# EAGLE design Cubesat_Potencia_Painel_Solar (EAGLE 6.2)
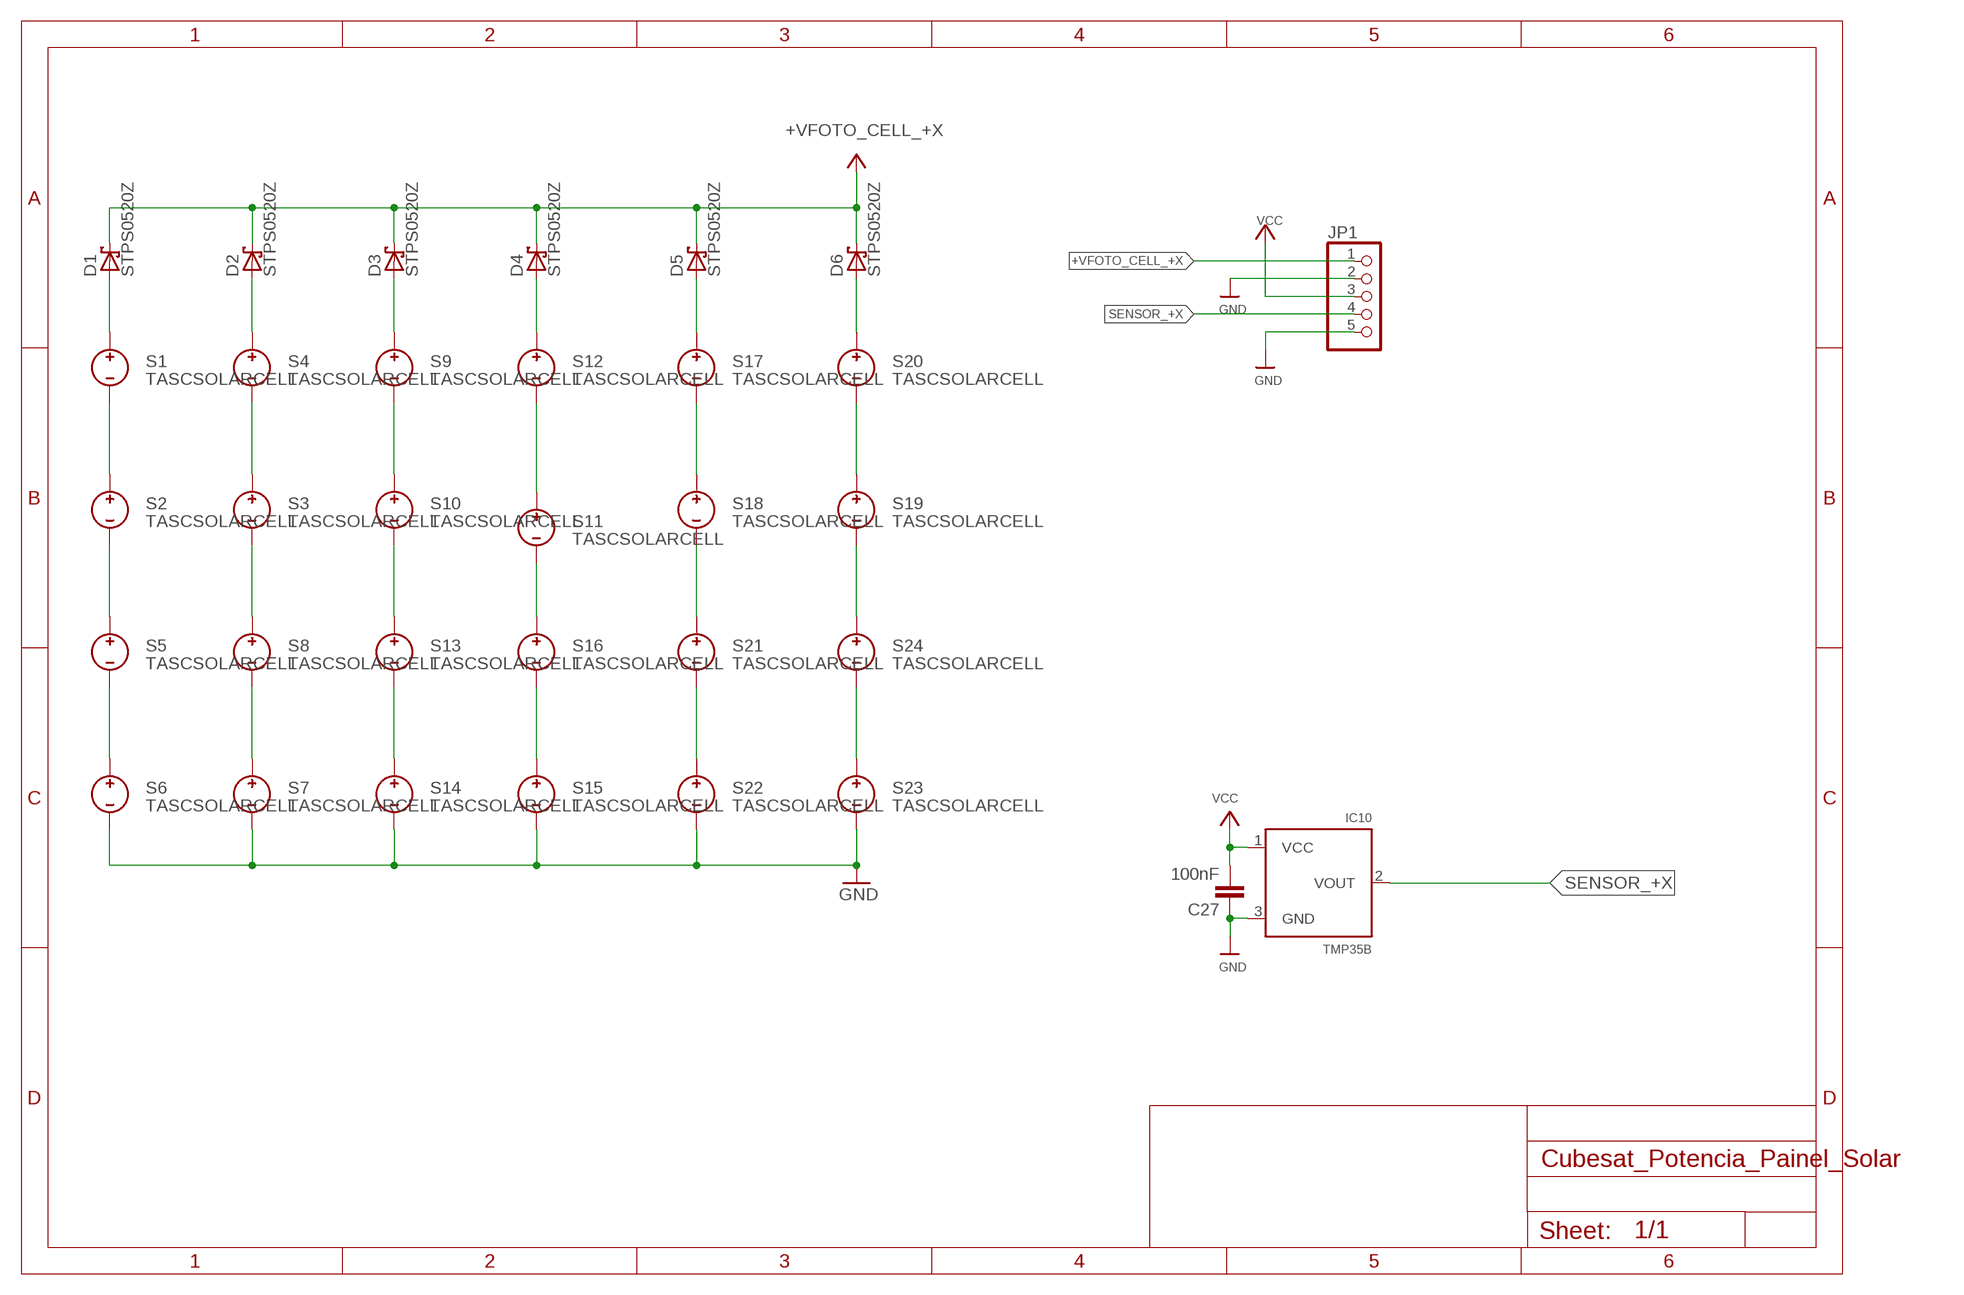
[diagram p0: schematic, sheet 1]

## Parts
C27  100nF  C-EUC0805  [C0805]
D1  STPS0520Z  [SOD-123]
D2  STPS0520Z  [SOD-123]
D3  STPS0520Z  [SOD-123]
D4  STPS0520Z  [SOD-123]
D5  STPS0520Z  [SOD-123]
D6  STPS0520Z  [SOD-123]
IC10  TMP35B  [TO92-LINE]
JP1  HEADER-1X5SMT  [1X05_SMT]
S1  TASCSOLARCELL  [TASCSOLARCELL]
S2  TASCSOLARCELL  [TASCSOLARCELL]
S3  TASCSOLARCELL  [TASCSOLARCELL]
S4  TASCSOLARCELL  [TASCSOLARCELL]
S5  TASCSOLARCELL  [TASCSOLARCELL]
S6  TASCSOLARCELL  [TASCSOLARCELL]
S7  TASCSOLARCELL  [TASCSOLARCELL]
S8  TASCSOLARCELL  [TASCSOLARCELL]
S9  TASCSOLARCELL  [TASCSOLARCELL]
S10  TASCSOLARCELL  [TASCSOLARCELL]
S11  TASCSOLARCELL  [TASCSOLARCELL]
S12  TASCSOLARCELL  [TASCSOLARCELL]
S13  TASCSOLARCELL  [TASCSOLARCELL]
S14  TASCSOLARCELL  [TASCSOLARCELL]
S15  TASCSOLARCELL  [TASCSOLARCELL]
S16  TASCSOLARCELL  [TASCSOLARCELL]
S17  TASCSOLARCELL  [TASCSOLARCELL]
S18  TASCSOLARCELL  [TASCSOLARCELL]
S19  TASCSOLARCELL  [TASCSOLARCELL]
S20  TASCSOLARCELL  [TASCSOLARCELL]
S21  TASCSOLARCELL  [TASCSOLARCELL]
S22  TASCSOLARCELL  [TASCSOLARCELL]
S23  TASCSOLARCELL  [TASCSOLARCELL]
S24  TASCSOLARCELL  [TASCSOLARCELL]

## Nets
+VFOTO_CELL_+X: D1.C D2.C D3.C D4.C D5.C D6.C JP1.1
GND: C27.1 IC10.3(GND) JP1.2 JP1.5 S6.N S7.N S14.N S15.N S22.N S23.N
N$1: D1.A S1.P
N$2: S1.N S2.P
N$3: S2.N S5.P
N$4: S5.N S6.P
N$5: S7.P S8.N
N$6: S3.N S8.P
N$7: S3.P S4.N
N$8: S13.N S14.P
N$9: S10.N S13.P
N$10: S9.N S10.P
N$11: S15.P S16.N
N$12: S11.N S16.P
N$13: S11.P S12.N
N$14: S21.N S22.P
N$15: S18.N S21.P
N$16: S17.N S18.P
N$17: S23.P S24.N
N$18: S19.N S24.P
N$19: S19.P S20.N
N$20: D2.A S4.P
N$21: D3.A S9.P
N$22: D4.A S12.P
N$23: D5.A S17.P
N$24: D6.A S20.P
SENSOR_+X: IC10.2(VOUT) JP1.4
VCC: C27.2 IC10.1(VCC) JP1.3

## Library data of the parts
C27 = rcl:C-EU: CAPACITOR, European symbol
D1-D6 = OSSI:STPS0520Z: We use STPS0520Z by st.com diode for solar cell schottky diode. If = 500mA Vrrm = 20V Vf max = 0.32V
IC10 = junior:TMP35
JP1 = junior:HEADER-1X5: PIN HEADER
S1-S24 = OSSI:TASCSOLARCELL

## Board
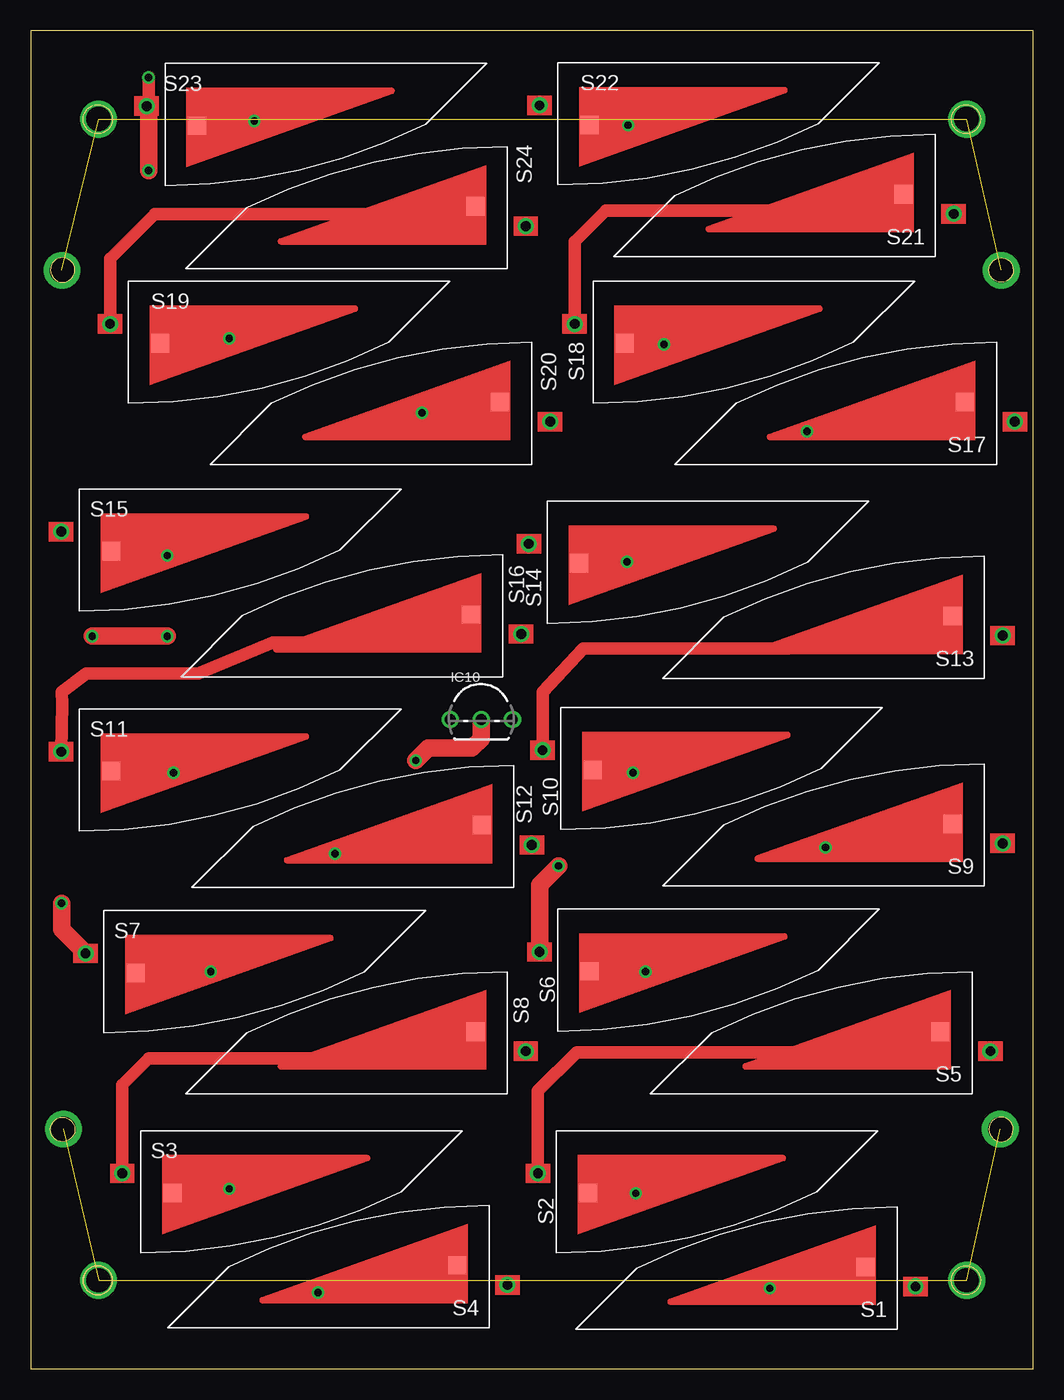
[diagram p1: board, top side]
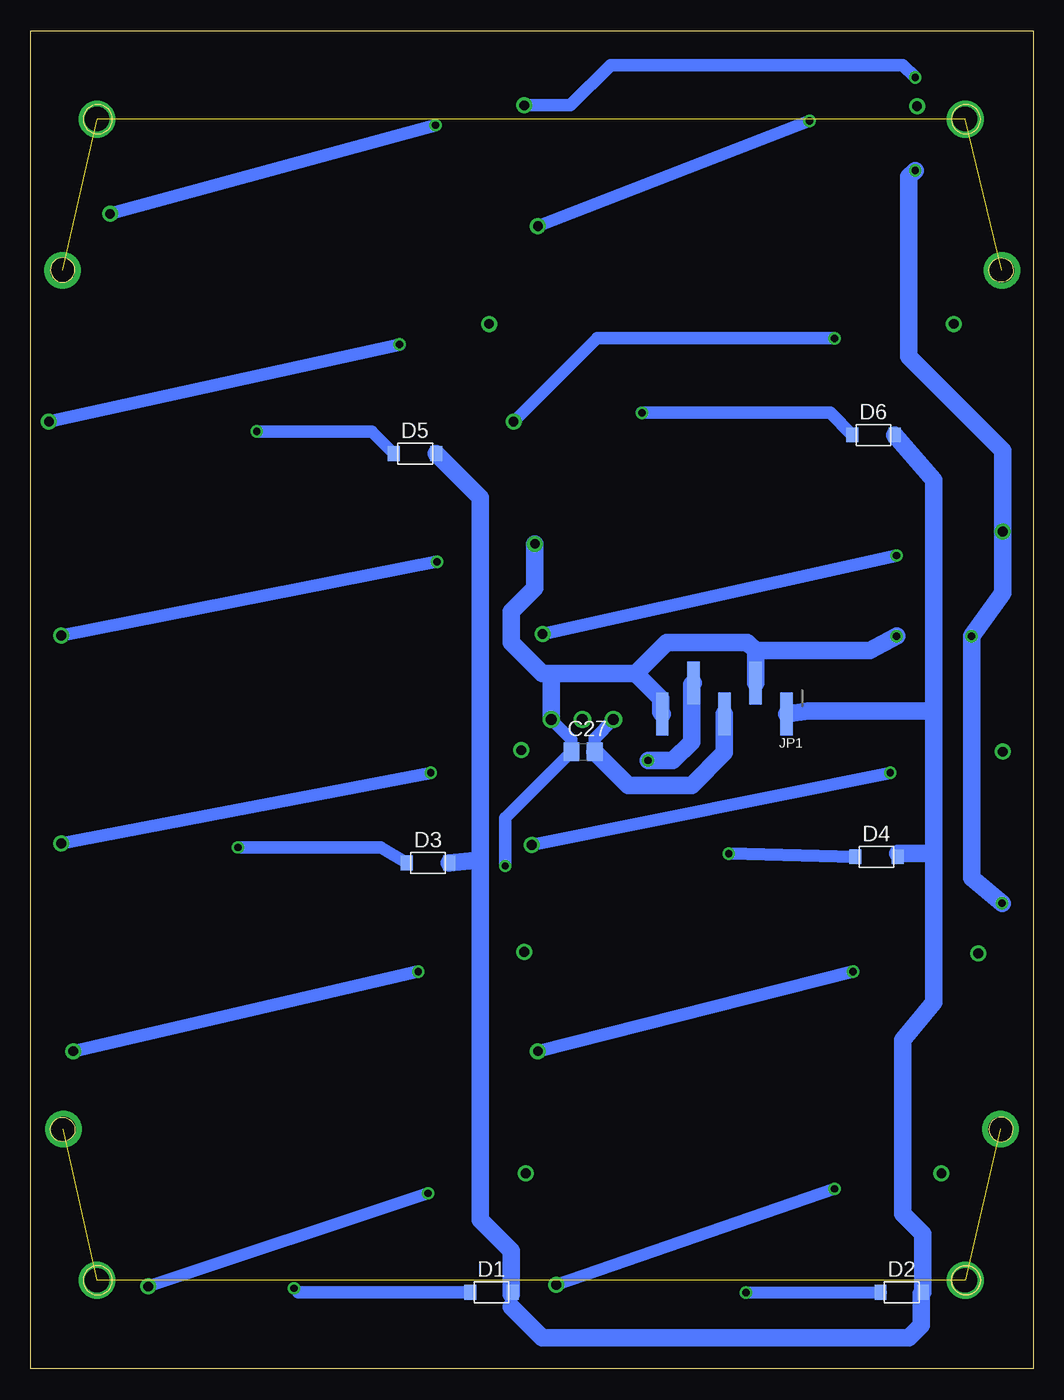
[diagram p2: board, bottom side, seen from below]

Size 82 x 109.5 mm. Coordinates in mm from the lower left corner, seen from the top.
Outline: 4.3,7.25 4.33,7.48 4.39,7.71 4.5,7.92 4.65,8.1
Outline: 4.3,7.25 4.32,7.02 4.39,6.79 4.5,6.58 4.65,6.4
Outline: 4.65,6.4 4.83,6.25 5.04,6.14 5.27,6.07 5.5,6.05
Outline: 5.5,6.05 5.73,6.07 5.96,6.14 6.17,6.25 6.35,6.4
Outline: 6.35,6.4 6.5,6.58 6.61,6.79 6.67,7.02 6.7,7.25
Outline: 6.7,7.25 6.68,7.48
Outline: 6.68,7.48 6.61,7.71 6.5,7.92 6.35,8.1
Outline: 6.35,8.1 6.17,8.25 5.96,8.36 5.73,8.43 5.5,8.45
Outline: 5.5,8.45 5.27,8.43 5.04,8.36 4.83,8.25 4.65,8.1
Outline: 77.68,102.48 77.7,102.25 77.68,102.02 77.61,101.79 77.5,101.58 77.35,101.4 77.17,101.25 76.96,101.14 76.73,101.07 76.5,101.05 76.27,101.07 76.04,101.14 75.83,101.25 75.65,101.4 75.5,101.58 75.39,101.79 75.32,102.02 75.3,102.25 75.32,102.48 75.39,102.71 75.5,102.92 75.65,103.1 75.83,103.25 76.04,103.36 76.27,103.43 76.5,103.45 76.73,103.43 76.96,103.36 77.17,103.25 77.35,103.1 77.5,102.92 77.61,102.71 77.68,102.48
Outline: 6.68,102.48 6.7,102.25 6.68,102.02 6.61,101.79 6.5,101.58 6.35,101.4 6.17,101.25 5.96,101.14 5.73,101.07 5.5,101.05 5.27,101.07 5.04,101.14 4.83,101.25 4.65,101.4 4.5,101.58 4.39,101.79 4.32,102.02 4.3,102.25 4.32,102.48 4.39,102.71 4.5,102.92 4.65,103.1 4.83,103.25 5.04,103.36 5.27,103.43 5.5,103.45 5.73,103.43 5.96,103.36 6.17,103.25 6.35,103.1 6.5,102.92 6.61,102.71 6.68,102.48
Outline: 77.7,7.25 77.68,7.48 77.7,7.25
Outline: 77.7,7.25 77.68,7.02
Outline: 77.68,7.02 77.61,6.79
Outline: 77.61,6.79 77.5,6.58
Outline: 77.5,6.58 77.35,6.4
Outline: 77.35,6.4 77.17,6.25
Outline: 77.17,6.25 76.96,6.14
Outline: 76.96,6.14 76.73,6.07
Outline: 76.73,6.07 76.5,6.05
Outline: 76.5,6.05 76.27,6.07
Outline: 76.27,6.07 76.04,6.14
Outline: 76.04,6.14 75.83,6.25
Outline: 75.83,6.25 75.65,6.4
Outline: 75.65,6.4 75.5,6.58
Outline: 75.5,6.58 75.39,6.79
Outline: 75.39,6.79 75.32,7.02
Outline: 75.32,7.02 75.3,7.25
Outline: 75.3,7.25 75.32,7.48
Outline: 75.32,7.48 75.39,7.71
Outline: 75.39,7.71 75.5,7.92
Outline: 75.5,7.92 75.65,8.1
Outline: 75.65,8.1 75.83,8.25
Outline: 75.83,8.25 76.04,8.36
Outline: 76.04,8.36 76.27,8.43
Outline: 76.27,8.43 76.5,8.45
Outline: 76.5,8.45 76.73,8.43
Outline: 76.73,8.43 76.96,8.36
Outline: 76.96,8.36 77.17,8.25
Outline: 77.17,8.25 77.35,8.1
Outline: 77.35,8.1 77.5,7.92
Outline: 77.5,7.92 77.61,7.71
Outline: 77.61,7.71 77.68,7.48 77.61,7.71
Outline: 6.68,7.48 6.7,7.25
Outline: 6.7,7.25 6.68,7.02
Outline: 6.68,7.02 6.61,6.79
Outline: 6.61,6.79 6.5,6.58
Outline: 6.5,6.58 6.35,6.4
Outline: 6.35,6.4 6.17,6.25
Outline: 6.17,6.25 5.96,6.14
Outline: 5.96,6.14 5.73,6.07
Outline: 5.73,6.07 5.5,6.05
Outline: 5.5,6.05 5.27,6.07
Outline: 5.27,6.07 5.04,6.14
Outline: 5.04,6.14 4.83,6.25
Outline: 4.83,6.25 4.65,6.4
Outline: 4.65,6.4 4.5,6.58
Outline: 4.5,6.58 4.39,6.79
Outline: 4.39,6.79 4.32,7.02
Outline: 4.32,7.02 4.3,7.25
Outline: 4.3,7.25 4.32,7.48
Outline: 4.32,7.48 4.39,7.71
Outline: 4.39,7.71 4.5,7.92
Outline: 4.5,7.92 4.65,8.1
Outline: 4.65,8.1 4.83,8.25
Outline: 4.83,8.25 5.04,8.36
Outline: 5.04,8.36 5.27,8.43
Outline: 5.27,8.43 5.5,8.45
Outline: 5.5,8.45 5.73,8.43
Outline: 5.73,8.43 5.96,8.36
Outline: 5.96,8.36 6.17,8.25
Outline: 6.17,8.25 6.35,8.1
Outline: 6.35,8.1 6.5,7.92
Outline: 6.5,7.92 6.61,7.71
Outline: 6.61,7.71 6.68,7.48 6.61,7.71
Outline: 77.7,7.25 77.68,7.02
Outline: 77.68,7.02 77.61,6.79
Outline: 77.61,6.79 77.5,6.58
Outline: 77.5,6.58 77.35,6.4
Outline: 77.35,6.4 77.17,6.25
Outline: 77.17,6.25 76.96,6.14
Outline: 76.96,6.14 76.73,6.07
Outline: 76.73,6.07 76.5,6.05
Outline: 76.5,6.05 76.27,6.07
Outline: 76.27,6.07 76.04,6.14
Outline: 76.04,6.14 75.83,6.25
Outline: 75.83,6.25 75.65,6.4
Outline: 75.65,6.4 75.5,6.58
Outline: 75.5,6.58 75.39,6.79
Outline: 75.39,6.79 75.32,7.02
Outline: 75.32,7.02 75.3,7.25
Outline: 75.3,7.25 75.32,7.48
Outline: 75.32,7.48 75.39,7.71
Outline: 75.39,7.71 75.5,7.92
Outline: 75.5,7.92 75.65,8.1
Outline: 75.65,8.1 75.83,8.25
Outline: 75.83,8.25 76.04,8.36
Outline: 76.04,8.36 76.27,8.43
Outline: 76.27,8.43 76.5,8.45
Outline: 76.5,8.45 76.73,8.43
Outline: 76.73,8.43 76.96,8.36
Outline: 76.96,8.36 77.17,8.25
Outline: 77.17,8.25 77.35,8.1
Outline: 77.35,8.1 77.5,7.92
Outline: 77.5,7.92 77.61,7.71
Outline: 6.68,7.48 6.7,7.25
Outline: 6.7,7.25 6.68,7.02
Outline: 6.68,7.02 6.61,6.79
Outline: 6.61,6.79 6.5,6.58
Outline: 6.5,6.58 6.35,6.4
Outline: 6.35,6.4 6.17,6.25
Outline: 6.17,6.25 5.96,6.14
Outline: 5.96,6.14 5.73,6.07
Outline: 5.73,6.07 5.5,6.05
Outline: 5.5,6.05 5.27,6.07
Outline: 5.27,6.07 5.04,6.14
Outline: 5.04,6.14 4.83,6.25
Outline: 4.83,6.25 4.65,6.4
Outline: 4.65,6.4 4.5,6.58
Outline: 4.5,6.58 4.39,6.79
Outline: 4.39,6.79 4.32,7.02
Outline: 4.32,7.02 4.3,7.25
Outline: 4.3,7.25 4.32,7.48
Outline: 4.32,7.48 4.39,7.71
Outline: 4.39,7.71 4.5,7.92
Outline: 4.5,7.92 4.65,8.1
Outline: 4.65,8.1 4.83,8.25
Outline: 4.83,8.25 5.04,8.36
Outline: 5.04,8.36 5.27,8.43
Outline: 5.27,8.43 5.5,8.45
Outline: 5.5,8.45 5.73,8.43
Outline: 5.73,8.43 5.96,8.36
Outline: 5.96,8.36 6.17,8.25
Outline: 6.17,8.25 6.35,8.1
Outline: 6.35,8.1 6.5,7.92
Outline: 6.5,7.92 6.61,7.71
Outline: 1.7,90.29 1.65,90.1 1.62,89.91 1.65,89.69 1.72,89.47 1.84,89.28 2,89.13 2.19,89.01 2.4,88.93 2.62,88.91 2.82,88.93 3.01,88.98 3.18,89.08 3.33,89.2 3.46,89.35 3.55,89.53 3.6,89.71 3.62,89.91 3.6,90.13 3.53,90.34 3.41,90.53 3.25,90.69 3.06,90.81 2.85,90.88 2.62,90.91 2.43,90.89 2.24,90.83 2.07,90.74 1.92,90.61 1.79,90.46 1.7,90.29
Outline: 82,109.5 0,109.5 0,0 82,0 82,109.5
Outline: 1.7,19.21 1.65,19.4 1.62,19.59 1.65,19.82 1.72,20.03 1.84,20.22 2,20.37 2.19,20.49 2.4,20.57 2.62,20.59 2.82,20.57 3.01,20.52 3.18,20.42 3.33,20.3 3.46,20.15 3.55,19.98 3.6,19.79 3.62,19.59 3.6,19.37 3.53,19.16 3.41,18.97 3.25,18.81 3.06,18.69 2.85,18.62 2.62,18.59 2.43,18.61 2.24,18.67 2.07,18.76 1.92,18.89 1.79,19.04 1.7,19.21
Outline: 80.3,19.21 80.35,19.4 80.38,19.59 80.35,19.82 80.28,20.03 80.16,20.22 80,20.37 79.81,20.49 79.6,20.57 79.38,20.59 79.18,20.57 78.99,20.52 78.82,20.42 78.67,20.3 78.54,20.15 78.45,19.98 78.4,19.79 78.38,19.59 78.4,19.37 78.47,19.16 78.59,18.97 78.75,18.81 78.94,18.69 79.15,18.62 79.38,18.59 79.57,18.61 79.76,18.67 79.93,18.76 80.08,18.89 80.21,19.04 80.3,19.21
Outline: 80.3,90.29 80.35,90.1 80.38,89.91 80.35,89.69 80.28,89.47 80.16,89.28 80,89.13 79.81,89.01 79.6,88.93 79.38,88.91 79.18,88.93 78.99,88.98 78.82,89.08 78.67,89.2 78.54,89.35 78.45,89.53 78.4,89.71 78.38,89.91 78.4,90.13 78.47,90.34 78.59,90.53 78.75,90.69 78.94,90.81 79.15,90.88 79.38,90.91 79.57,90.89 79.76,90.83 79.93,90.74 80.08,90.61 80.21,90.46 80.3,90.29
Copper layers (1*16): Top 0.035mm / dielectric 1.5mm / Bottom 0.035mm
Design rules: minimum track width 10mil, minimum drill 24mil, track to track 8mil, track to pad 8mil, pad to pad 8mil, via to via 8mil, smd to smd 8mil, copper to edge 40mil, drill to drill 8mil, minimum pad ring 10mil, minimum via ring 8mil, stop-mask expansion 4mil, vias tented up to drill 0mil, thermal gap 10mil

### Footprints (pad centres in the part's own frame; a part is rotated, then mirrored left to right if it is on the bottom)
C0805 = smd 1.3 x 1.5: 1 -0.95,0; 2 0.95,0
SOD-123 = smd 0.97 x 1.2: A -1.735,0; C 1.735,0
TO92-LINE = drill 0.9: 1 -2.54,0; 2 0,0; 3 2.54,0
1X05_SMT = smd 1 x 3.5: 1 -5.08,1.27; 2 -2.54,-1.27; 3 0,1.27; 4 2.54,-1.27; 5 5.08,1.27
TASCSOLARCELL = drill 0.8: N 1.5,3.5 | smd 1.5 x 1.5: P -2.6,5.1

### Placement (x,y rotation side)
C27  36.81,50.49 0 bottom
D1  44.3,6.27 0 bottom
D2  10.75,6.27 0 bottom
D3  49.49,41.39 0 bottom
D4  12.82,41.9 0 bottom
D5  50.55,74.89 0 bottom
D6  13.06,76.41 0 bottom
IC10  36.87,53.13 0 top
JP1  25.25,54.86 180 bottom
S1  70.88,3.25 0 top
S2  43,19.5 180 top
S3  9,19.5 180 top
S4  37.5,3.38 0 top
S5  77,22.5 0 top
S6  43.12,37.62 180 top
S7  6,37.5 180 top
S8  39,22.5 0 top
S9  78,39.5 0 top
S10  43.38,54.12 180 top
S11  4,54 180 top
S12  39.5,39.38 0 top
S13  78,56.5 0 top
S14  42.25,71 180 top
S15  4,72 180 top
S16  38.62,56.62 0 top
S17  79,74 0 top
S18  46,89 180 top
S19  8,89 180 top
S20  41,74 0 top
S21  74,91 0 top
S22  43.12,106.88 180 top
S23  11,106.82 180 top
S24  39,90 0 top

### Tracks (layer width: path | path; a pad name or v marks a point on that pad's centre or on a via)
+VFOTO_CELL_+X
  Bottom 1.016: D1.C 42.56,9.54 42.67,9.65 45.21,12.19 45.21,41.66 | D4.C 11.08,42.16 | 42.67,6.1 42.67,5.08 | 9.14,6.14 D2.C
  Bottom 1.422: 45.21,41.66 45.21,71.28 D5.C | D3.C 45.21,41.66 | D6.C 8.13,72.71 8.13,62.48 8.13,53.85 | 8.13,53.85 8.13,42.16 | 8.13,42.16 8.13,29.97 10.67,26.92 10.67,15.75 10.67,12.7 9.02,11.05 D2.C | 11.08,42.16 8.13,42.16 | 45.21,41.66 45.21,12.19 42.67,9.65 42.67,6.1 | 42.67,5.08 40.13,2.54 10.16,2.54 9.14,3.56 9.14,6.14 | JP1.1 18.39,53.85 8.13,53.85
GND  (via drill 0.6)
  Top 1.016: v9.65,105.66 9.65,103.47 S23.N
  Top 1.422: v2.54,38.1 2.54,35.96 S7.N | S6.N 41.62,39.59 v43.18,41.15 | v11.18,59.94 v5.04,59.94 | v9.65,98.04 9.65,103.17 S23.N
  Bottom 1.016: v43.18,41.15 43.18,41.66 43.18,45.07 C27.1 37.76,51.49 IC10.3 | S22.N 37.85,103.38 34.54,106.68 10.67,106.68 v9.65,105.66
  Bottom 1.422: 2.5,63.5 S15.N 2.5,75.14 10.16,82.8 10.16,97.54 v9.65,98.04 | 2.5,63.5 v5.04,59.94 | v5.04,59.94 5.04,40.17 v2.54,38.1 | S14.N 40.75,63.9 42.67,61.98 42.67,59.44 40.13,56.9 39.62,56.9 | 39.62,56.9 32.51,56.9 | 32.51,56.9 30.48,54.86 30.48,53.74 JP1.5 | JP1.2 22.71,58.78 | 22.71,58.78 23.37,59.44 29.97,59.44 32.51,56.9 | IC10.3 39.41,56.68 39.62,56.9 | 22.71,58.78 13.36,58.78 v11.18,59.94 | v5.04,59.94 2.5,63.5
N$1  (via drill 0.6)
  Top 1.016: v60.45,6.6 66.53,6.6 S1.P
  Bottom 1.016: D1.A 60.12,6.27 v60.45,6.6
N$2  (via drill 0.6)
  Top 1.016: S2.P v49.5,14.38
  Bottom 1.016: v49.5,14.38 S1.N
N$3
  Top 1.016: S2.N 41.5,22.75 44.66,25.91 65.53,25.91 S5.P
N$4  (via drill 0.6)
  Top 1.016: v50.29,32.51 S6.P
  Bottom 1.016: S5.N v50.29,32.51
N$5  (via drill 0.6)
  Top 1.016: v14.73,32.51 S7.P
  Bottom 1.016: S8.N v14.73,32.51
N$6
  Top 1.016: S3.N 7.5,23.25 9.65,25.4 25.91,25.4 26.42,25.91 34.71,25.91 S8.P
N$7  (via drill 0.6)
  Top 1.016: S3.P 15.92,14.4 v16.26,14.73
  Bottom 1.016: v16.26,14.73 S4.N
N$8  (via drill 0.6)
  Top 1.016: S14.P 48.63,65.9 v48.77,66.04
  Bottom 1.016: v48.77,66.04 S13.N
N$9
  Top 1.016: S10.N 41.88,55.38 45.21,58.93 61.98,58.93 S13.P
N$10  (via drill 0.6)
  Top 1.016: S10.P v49.28,48.77
  Bottom 1.016: v49.28,48.77 S9.N
N$11  (via drill 0.6)
  Top 1.016: v11.18,66.55 S15.P
  Bottom 1.016: S16.N v11.18,66.55
N$12
  Top 1.016: S11.N 2.58,54.4 2.54,55.37 4.57,56.9 13.72,56.9 19.81,59.44 23.37,59.44 23.88,59.94 34.24,59.94 S16.P
N$13  (via drill 0.6)
  Top 1.016: v11.68,48.77 S11.P
  Bottom 1.016: S12.N v11.68,48.77
N$14  (via drill 0.6)
  Top 1.016: S22.P v48.88,101.75
  Bottom 1.016: v48.88,101.75 S21.N
N$15
  Top 1.016: S21.P 70.88,94.75 47.04,94.75 44.5,92.21 S18.N
N$16  (via drill 0.6)
  Top 1.016: S18.P v51.82,83.82
  Bottom 1.016: v51.82,83.82 S17.N
N$17  (via drill 0.6)
  Top 1.016: v18.29,102.11 S23.P
  Bottom 1.016: S24.N v18.29,102.11
N$18
  Top 1.016: S19.N 6.5,90.83 10.16,94.49 30.48,94.49 35.79,94.49 S24.P
N$19  (via drill 0.6)
  Top 1.016: v16.26,84.33 15.83,83.9 S19.P
  Bottom 1.016: S20.N 35.67,84.33 v16.26,84.33
N$20  (via drill 0.6)
  Top 1.016: v23.5,6.25 S4.P
  Bottom 1.016: D2.A v23.5,6.25
N$21  (via drill 0.6)
  Top 1.016: v65.02,42.67 70.61,42.67 S9.P
  Bottom 1.016: D3.A 53.34,42.67 v65.02,42.67
N$22  (via drill 0.6)
  Top 1.016: v24.89,42.16 arc19 S12.P
  Bottom 1.016: D4.A v24.89,42.16
N$23  (via drill 0.6)
  Top 1.016: v63.5,76.71 74.01,76.71 arc90 S17.P
  Bottom 1.016: D5.A 54.11,76.71 v63.5,76.71
N$24  (via drill 0.6)
  Top 1.016: v32,78.23 32.87,79.1 S20.P
  Bottom 1.016: D6.A 16.61,78.23 v32,78.23
N$25  (via drill 2)  (3 unrouted)
  other vias: 79.39,89.88 2.56,89.88 5.56,102.25 76.56,102.25
N$26  (via drill 2)  (3 unrouted)
  other vias: 5.56,7.25 76.56,7.25 2.69,19.63 79.31,19.63
SENSOR_+X  (via drill 0.6)
  Top 1.422: IC10.2 36.87,51.52 36.07,50.8 33.53,50.8 32.51,50.8 v31.5,49.78
  Bottom 1.422: v31.5,49.78 29.46,49.78 27.94,51.31 27.94,54.86 27.94,55.98 JP1.4
VCC
  Bottom 1.016: C27.2 35.86,51.6 IC10.1
  Bottom 1.422: JP1.3 25.25,50.44 27.94,47.75 33.12,47.75 C27.2